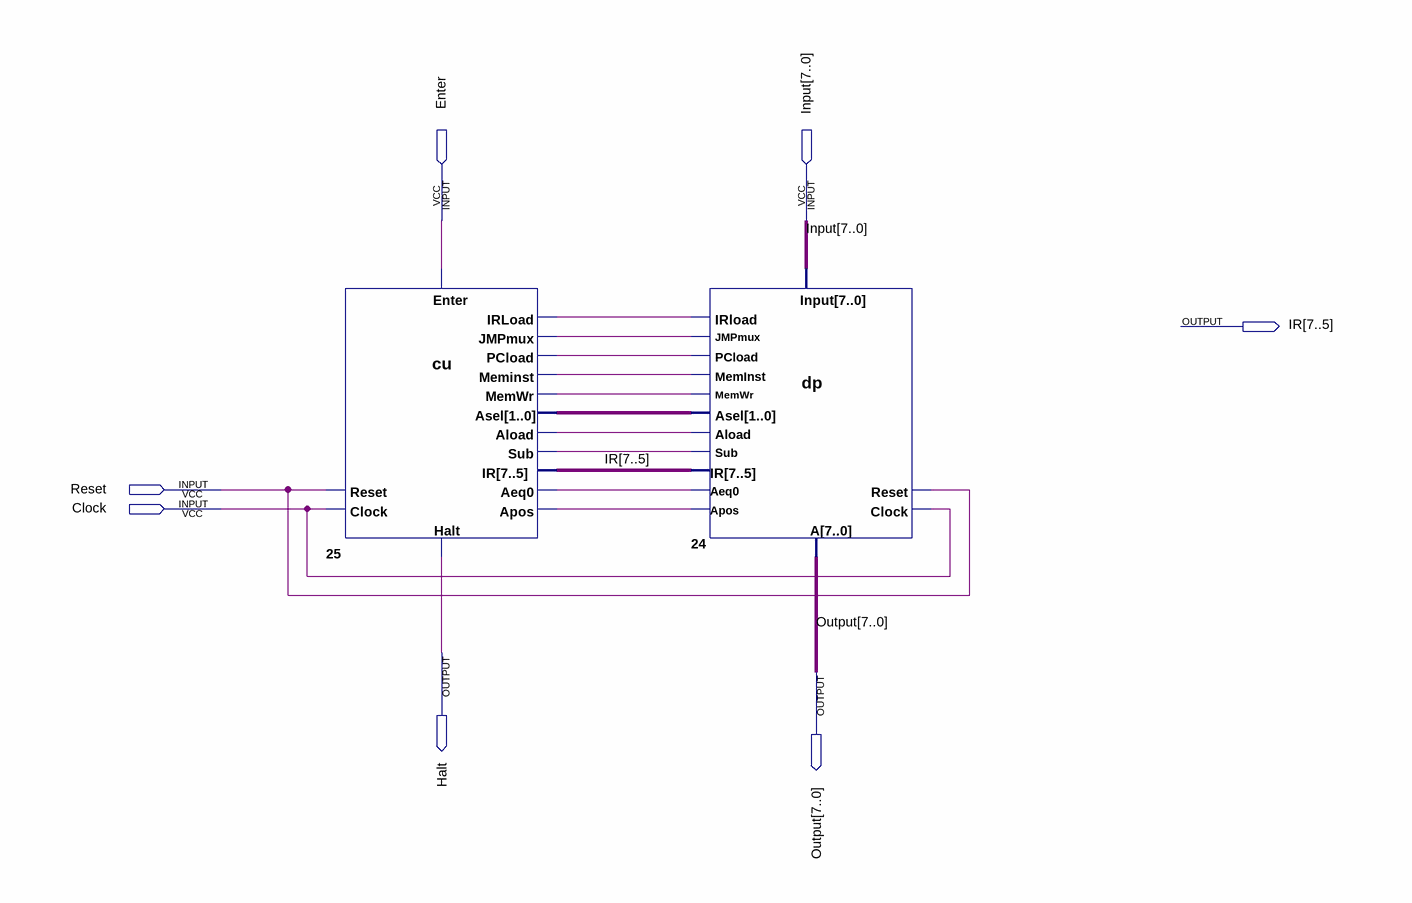
[diagram p0: schematic sheet]
// Quartus schematic mp.bdf as structural Verilog: 2 symbols, 7 pins
module mp (
  input  Enter,
  input  [7:0] Input,
  input  Reset,
  input  Clock,
  output [7:5] IR,
  output Halt,
  output [7:0] Output
);

  wire n24_aeq0, n24_apos, n25_aload, n25_irload, n25_jmpmux, n25_meminst, n25_memwr, n25_pcload, n25_sub;
  wire [1:0] n25_asel;

  cu u_25 (
    .Enter(Enter), .IR(IR), .Aeq0(n24_aeq0), .Apos(n24_apos), .Reset(Reset), .Clock(Clock),
    .IRLoad(n25_irload), .JMPmux(n25_jmpmux), .PCload(n25_pcload), .Meminst(n25_meminst), .MemWr(n25_memwr),
    .Asel(n25_asel), .Aload(n25_aload), .Sub(n25_sub), .Halt(Halt));
  dp u_24 (
    .JMPmux(n25_jmpmux), .PCload(n25_pcload), .MemInst(n25_meminst), .MemWr(n25_memwr), .Asel(n25_asel),
    .Aload(n25_aload), .Reset(Reset), .Clock(Clock), .Sub(n25_sub), .IRload(n25_irload), .Input(Input),
    .Apos(n24_apos), .Aeq0(n24_aeq0), .IR(IR), .A(Output));
endmodule
